# Altium schematic sheet CCP_IO.SchDoc
size A
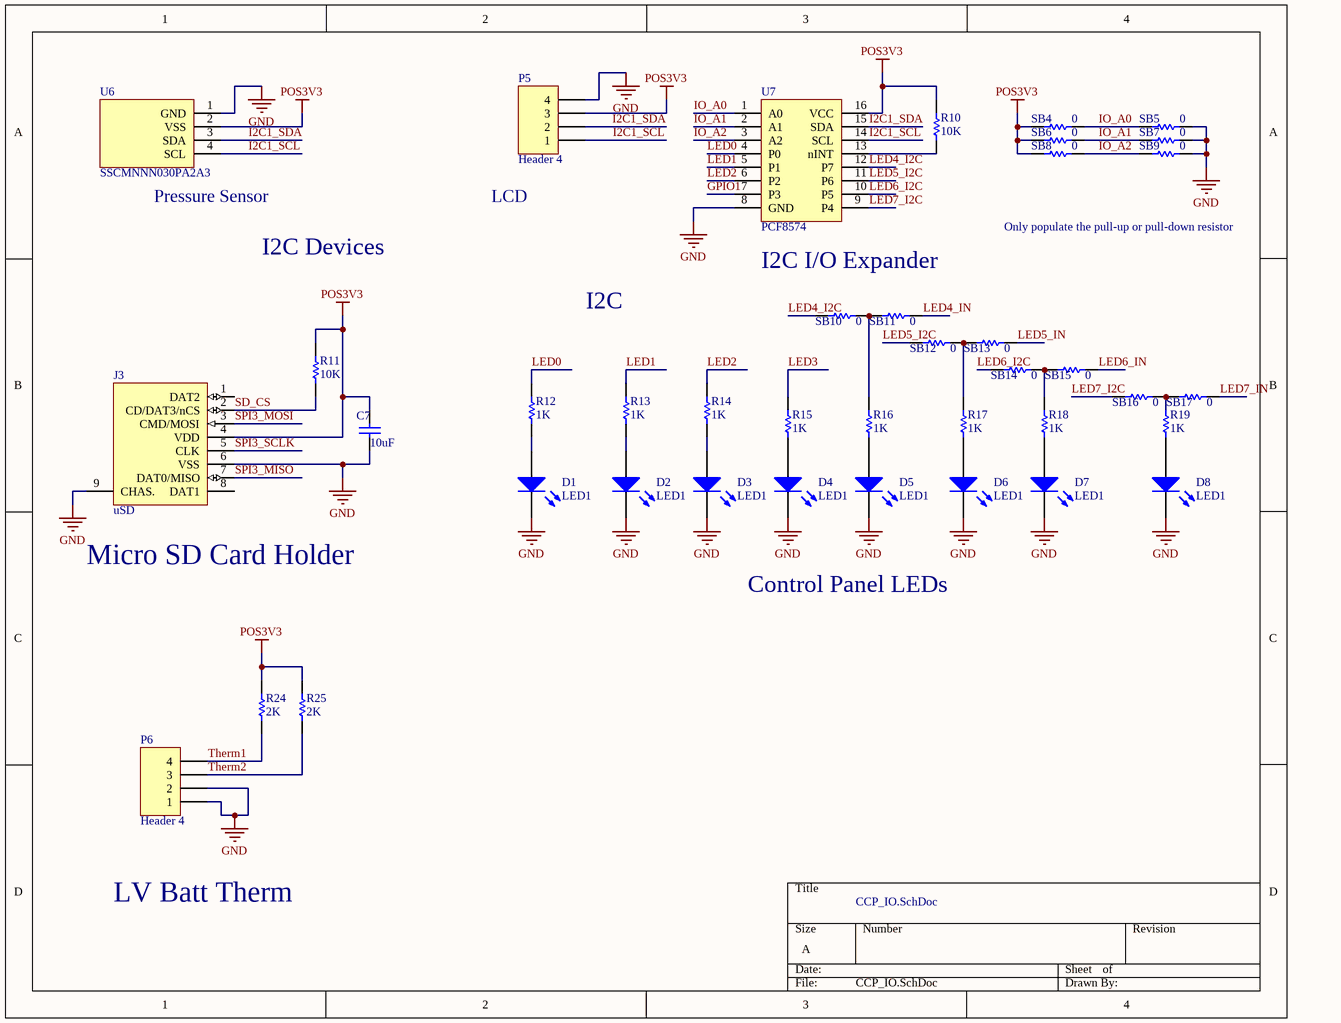
[diagram p0: CCP_IO.SchDoc]

## Parts
C7  value 10uF  [C1206]  (hidden comment: Cap)
D1  LED1  [2 Pin Jumper]
D2  LED1  [2 Pin Jumper]
D3  LED1  [2 Pin Jumper]
D4  LED1  [2 Pin Jumper]
D5  LED1  [2 Pin Jumper]
D6  LED1  [2 Pin Jumper]
D7  LED1  [2 Pin Jumper]
D8  LED1  [2 Pin Jumper]
J3  uSD  [MICRO_SD_HOLDER]
P5  Header 4  [4POS TERM BLOCK]
P6  Header 4  [HDR1X4]
R10  value 10K  [6-0805_M]  (hidden comment: Res1)
R11  value 10K  [6-0805_M]  (hidden comment: Res1)
R12  value 1K  [1206]  (hidden comment: Res1)
R13  value 1K  [1206]  (hidden comment: Res1)
R14  value 1K  [1206]  (hidden comment: Res1)
R15  value 1K  [1206]  (hidden comment: Res1)
R16  value 1K  [1206]  (hidden comment: Res1)
R17  value 1K  [1206]  (hidden comment: Res1)
R18  value 1K  [1206]  (hidden comment: Res1)
R19  value 1K  [1206]  (hidden comment: Res1)
R24  value 2K  [6-0805_M]  (hidden comment: Res1)
R25  value 2K  [6-0805_M]  (hidden comment: Res1)
SB4  value 0  [6-0805_M]  (hidden comment: Res1)
SB5  value 0  [6-0805_M]  (hidden comment: Res1)
SB6  value 0  [6-0805_M]  (hidden comment: Res1)
SB7  value 0  [6-0805_M]  (hidden comment: Res1)
SB8  value 0  [6-0805_M]  (hidden comment: Res1)
SB9  value 0  [6-0805_M]  (hidden comment: Res1)
SB10  value 0  [6-0805_M]  (hidden comment: Res1)
SB11  value 0  [6-0805_M]  (hidden comment: Res1)
SB12  value 0  [6-0805_M]  (hidden comment: Res1)
SB13  value 0  [6-0805_M]  (hidden comment: Res1)
SB14  value 0  [6-0805_M]  (hidden comment: Res1)
SB15  value 0  [6-0805_M]  (hidden comment: Res1)
SB16  value 0  [6-0805_M]  (hidden comment: Res1)
SB17  value 0  [6-0805_M]  (hidden comment: Res1)
U6  SSCMNNN030PA2A3  [8-SMT]
U7  PCF8574  [16-SOIC]

## Nets
GND: C7.1 D1.2(K) D2.2(K) D3.2(K) D4.2(K) D5.2(K) D6.2(K) D7.2(K) D8.2(K) J3.6(VSS) J3.9(CHAS.) P5.4 P6.1 P6.2 SB5.1 SB7.1 SB9.1 U6.1(GND) U7.8(GND)
POS3V3: C7.2 J3.4(VDD) P5.3 R10.2 R11.1 R24.2 R25.2 SB4.2 SB6.2 SB8.2 U6.2(VSS) U7.16(VCC)
GPIO1: U7.7(P3)
I2C1_SCL: P5.1 U6.4(SCL) U7.14(SCL)
I2C1_SDA: P5.2 U6.3(SDA) U7.15(SDA)
IO_A0: SB4.1 SB5.2 U7.1(A0)
IO_A1: SB6.1 SB7.2 U7.2(A1)
IO_A2: SB8.1 SB9.2 U7.3(A2)
LED0: R12.2 U7.4(P0)
LED1: R13.2 U7.5(P1)
LED2: R14.2 U7.6(P2)
LED3: R15.2
LED4_I2C: SB10.2 U7.12(P7)
LED4_IN: SB11.1
LED5_I2C: SB12.2 U7.11(P6)
LED5_IN: SB13.1
LED6_I2C: SB14.2 U7.10(P5)
LED6_IN: SB15.1
LED7_I2C: SB16.2 U7.9(P4)
LED7_IN: SB17.1
SD_CS: J3.2(CD/DAT3/nCS) R11.2
SPI3_MISO: J3.7(DAT0/MISO)
SPI3_MOSI: J3.3(CMD/MOSI)
SPI3_SCLK: J3.5(CLK)
Therm1: P6.4 R24.1
Therm2: P6.3 R25.1
NetD1_1: D1.1(A) R12.1
NetD2_1: D2.1(A) R13.1
NetD3_1: D3.1(A) R14.1
NetD4_1: D4.1(A) R15.1
NetD5_1: D5.1(A) R16.1
NetD6_1: D6.1(A) R17.1
NetD7_1: D7.1(A) R18.1
NetD8_1: D8.1(A) R19.1
NetR10_1: R10.1 U7.13(nINT)
NetR16_2: R16.2 SB10.1 SB11.2
NetR17_2: R17.2 SB12.1 SB13.2
NetR18_2: R18.2 SB14.1 SB15.2
NetR19_2: R19.2 SB16.1 SB17.2

Not connected (* = marked no-connect by the designer): J3 1(DAT2) 8(DAT1)

## Notes on the sheet
- (near U6) Pressure Sensor
- LCD
- Only populate the pull-up or pull-down resistor
- I2C Devices
- I2C I/O Expander
- I2C
- (near J3) Micro SD Card Holder
- Control Panel LEDs
- LV Batt Therm
- CCP_IO.SchDoc

## Library data of the parts
C7 = Cap: Capacitor; Published: 8-Jun-2000; LatestRevisionDate: 17-Jul-2002; LatestRevisionNote: Re-released for DXP Platform.; PackageReference: RAD-0.3; Publisher: Altium Limited; PackageDescription: Radial Cap, Thru-Hole; 2 Leads; 0.3 in Pin Spacing
D1-D8 = LED1: Typical RED GaAs LED; Published: 8-Jun-2000; LatestRevisionDate: 08-Jul-2005; LatestRevisionNote: Mech Layer 1 removed.; PackageReference: LED-1; Publisher: Altium Limited; PackageDescription: LED; 2 Leads
J3 = SD Card
P5 P6 = Header 4: Header, 4-Pin; LatestRevisionDate: 17-Jul-2002; LatestRevisionNote: Re-released for DXP Platform.; Publisher: Altium Limited
R10-R19 R24 R25 SB4-SB17 = Res1: Resistor; Published: 8-Jun-2000; LatestRevisionDate: 17-Jul-2002; LatestRevisionNote: Re-released for DXP Platform.; PackageReference: AXIAL-0.3; Publisher: Altium Limited; PackageDescription: Axial Device, Thru-Hole; 2 Leads; 0.3 in Pin Spacing
U6 = SSCMNNN030PA2A3: Honeywell Digital Pressure Sensor; ComponentLink1Description: Part; ComponentLink1URL: https://www.digikey.com/product-detail/en/honeywell-sensing-and-productivity-solutions/SSCMNNN030PA2A3/480-6407-ND/2416123; ComponentLink2Description: Datasheet; ComponentLink2URL: https://sensing.honeywell.com/index.php?ci_id=151134
U7 = PCF8574: I2C I/O Expander; ComponentLink1Description: Part; ComponentLink1URL: https://www.digikey.com/product-detail/en/texas-instruments/PCF8574DWR/296-13108-1-ND/484579; ComponentLink2Description: Datasheet; ComponentLink2URL: http://www.ti.com/lit/ds/symlink/pcf8574.pdf